# EAGLE design lower_traced_flip2040 (EAGLE 9.6.2)
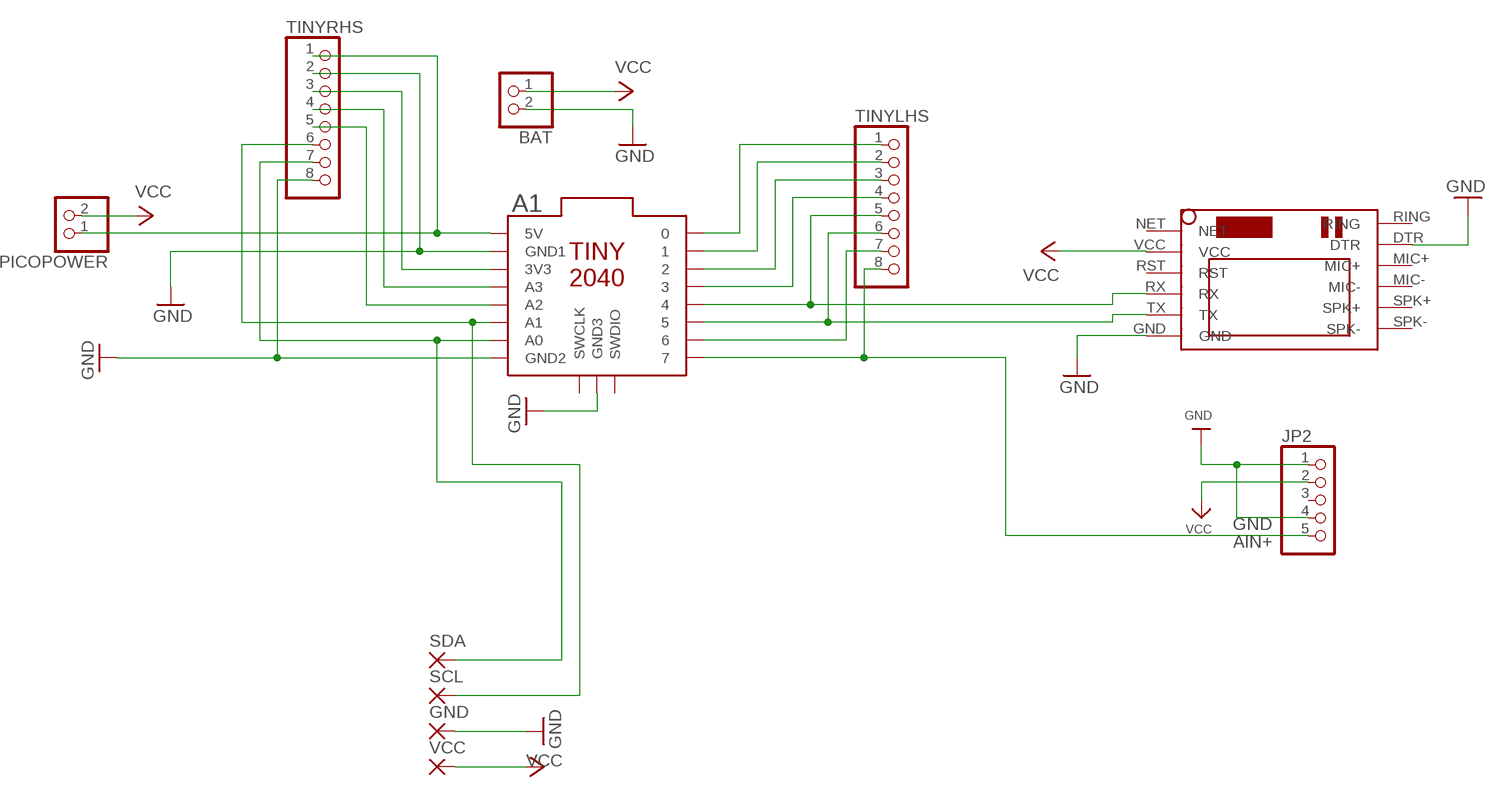
[diagram p0: schematic, sheet 1]

## Parts
A1  TINY2040  [TINY2040]
BAT  JST_2PIN-THM-RA  [JST-PH-2-THM-RA]
GND  3,17/1,1  [3,17/1,1]
JP2  HEADER-1X570MIL  [1X05_ROUND_70]
PICOPOWER  PINHD-1X2  [1X02]
SCL  3,17/1,1  [3,17/1,1]
SDA  3,17/1,1  [3,17/1,1]
TINYLHS  PINHD-1X8  [1X08]
TINYRHS  PINHD-1X8  [1X08]
U$2  SIM800LMODULE  [SIM800LMODULE]
VCC  3,17/1,1  [3,17/1,1]

## Nets
AIN+: A1.7 JP2.5 TINYLHS.8
GND: A1.GND1 A1.GND2 A1.GND3 BAT.2 GND.1(P) JP2.1 JP2.4 TINYRHS.2 TINYRHS.8 U$2.DTR U$2.GND
N$1: A1.4 TINYLHS.5 U$2.RX
N$2: A1.5 TINYLHS.6 U$2.TX
N$3: A1.A1 SCL.1(P) TINYRHS.6
N$4: A1.A0 SDA.1(P) TINYRHS.7
N$5: A1.5V PICOPOWER.1 TINYRHS.1
N$7: A1.6 TINYLHS.7
N$10: A1.3 TINYLHS.4
N$11: A1.2 TINYLHS.3
N$12: A1.1 TINYLHS.2
N$13: A1.0 TINYLHS.1
N$14: A1.A2 TINYRHS.5
N$15: A1.A3 TINYRHS.4
N$16: A1.3V3 TINYRHS.3
VCC: BAT.1 JP2.2 PICOPOWER.2 U$2.VCC VCC.1(P)
Unconnected: A1.SWCLK A1.SWDIO JP2.3 U$2.MIC+ U$2.MIC- U$2.NET U$2.RING U$2.RST U$2.SPK+ U$2.SPK-

## Library data of the parts
A1 = pimoroni-boards:TINY2040
BAT = adafruit:JST_2PIN: JST 2-Pin Connectors of various flavors SMT-RA (S2B-PH-SM4) 4UConnector #17311 SMT (B2B-PH-SM4) THM-RA (S2B-PH) THM (B2B-PH)
GND SCL SDA VCC = wirepad:3,17/1,1: THROUGH-HOLE PAD
JP2 = microbuilder:HEADER-1X5: PIN HEADER
PICOPOWER = pinhead:PINHD-1X2: PIN HEADER
TINYLHS TINYRHS = pinhead:PINHD-1X8: PIN HEADER
U$2 = SIM800LMODULE:SIM800LMODULE: SIM800L Module

## Board
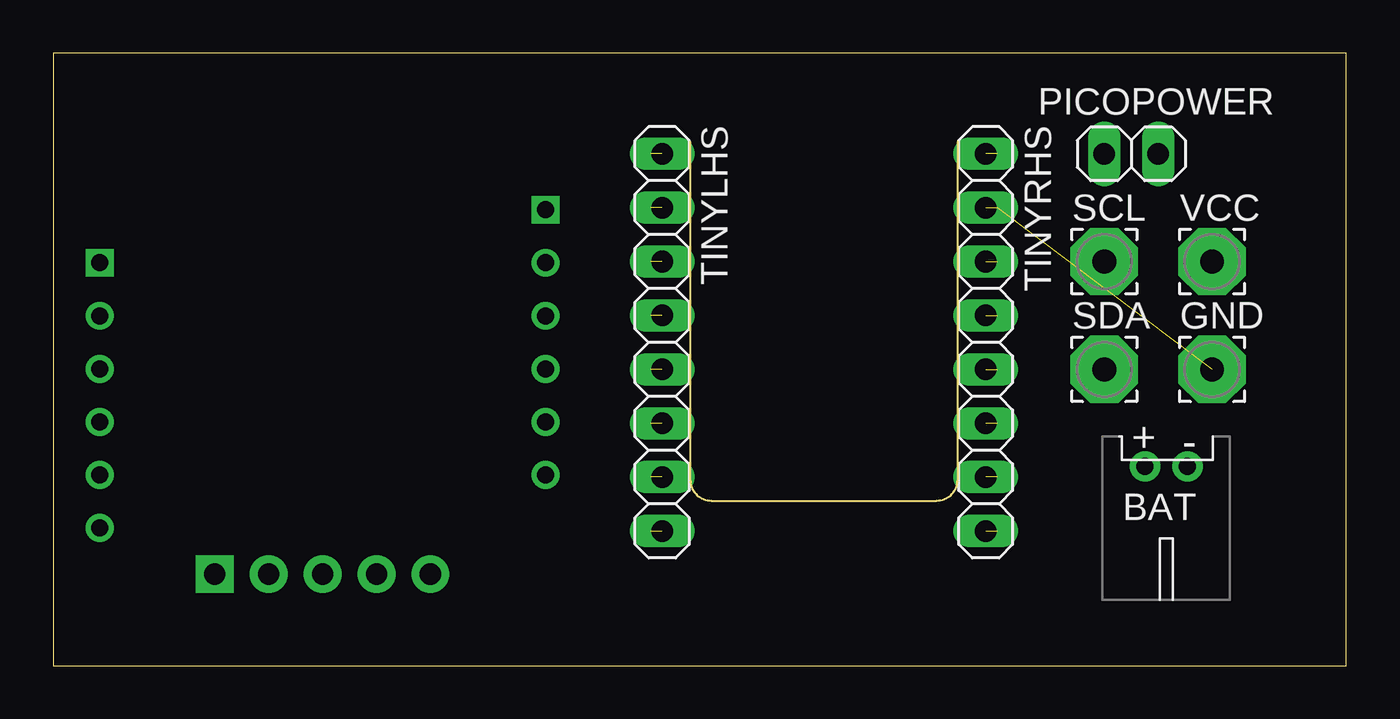
[diagram p1: board, top side]
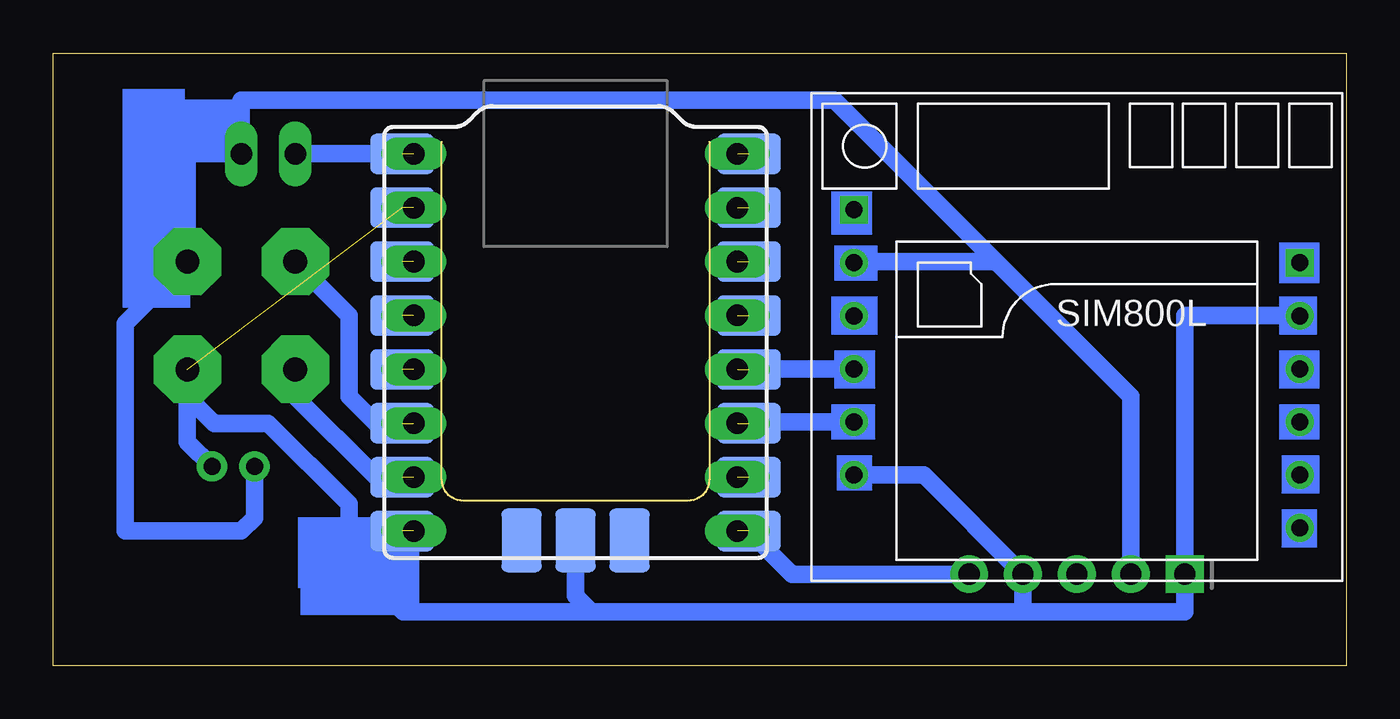
[diagram p2: board, bottom side, seen from below]

Size 60.94 x 28.88 mm. Coordinates in mm from the lower left corner, seen from the top.
Outline: 0,0 60.94,0 60.94,28.88 0,28.88 0,0
Copper layers (1*16): Top 0.035mm / dielectric 1.5mm / Bottom 0.035mm
Design rules "default": minimum track width 6mil, minimum drill 0.35mm, track to track 6mil, track to pad 6mil, pad to pad 6mil, via to via 6mil, smd to smd 6mil, copper to edge 40mil, drill to drill 6mil, minimum pad ring 10mil, minimum via ring 8mil, stop-mask expansion 4mil, vias tented up to drill 0mil, thermal gap 10mil

### Footprints (pad centres in the part's own frame; a part is rotated, then mirrored left to right if it is on the bottom)
TINY2040 = smd 1.9 x 3: 0 1.27,8.17; 1 3.81,8.17; 2 6.35,8.17; 3 8.89,8.17; 3V3 6.35,-8.17; 4 11.43,8.17; 5 13.97,8.17; 5V 1.27,-8.17; 6 16.51,8.17; 7 19.05,8.17; A0 16.51,-8.17; A1 13.97,-8.17; A2 11.43,-8.17; A3 8.89,-8.17; GND1 3.81,-8.17; GND2 19.05,-8.17 | smd 3 x 1.9: GND3 19.49,0; SWCLK 19.49,-2.54; SWDIO 19.49,2.54
JST-PH-2-THM-RA = drill 0.8 pad 1.422: 1 1,0; 2 -1,0
3,17/1,1 = drill 1.118 pad 3.175 octagon: 1 0,0
1X05_ROUND_70 = drill 1 pad 1.778 square: 1 -5.08,0 | drill 1 pad 1.778: 2 -2.54,0; 3 0,0; 4 2.54,0; 5 5.08,0
1X02 = drill 1.016 long: 1 -1.27,0; 2 1.27,0
1X08 = drill 1.016 long: 1 -8.89,0; 2 -6.35,0; 3 -3.81,0; 4 -1.27,0; 5 1.27,0; 6 3.81,0; 7 6.35,0; 8 8.89,0
SIM800LMODULE = drill 0.8: DTR 10.5,1; GND -10.5,-6.5; MIC+ 10.5,-1.5; MIC- 10.5,-4; RST -10.5,1; RX -10.5,-1.5; SPK+ 10.5,-6.5; SPK- 10.5,-9; TX -10.5,-4; VCC -10.5,3.5 | drill 0.8 square: NET -10.5,6; RING 10.5,3.5

### Placement (x,y rotation side)
A1  36.32,25.4 270 bottom
BAT  52.45,9.4 180 top
GND  54.61,13.97 0 top
JP2  12.7,4.32 180 bottom
PICOPOWER  50.8,24.13 0 top
SCL  49.53,19.05 0 top
SDA  49.53,13.97 0 top
TINYLHS  28.7,15.24 270 top
TINYRHS  43.94,15.24 270 top
U$2  12.7,15.49 0 bottom
VCC  54.61,19.05 0 top

### Tracks (layer width: path | path; a pad name or v marks a point on that pad's centre or on a via)
AIN+  (1 unrouted)
  Bottom 0.813: A1.7 26.12,4.32 JP2.5
GND  (3 unrouted)
  Bottom 0.813: U$2.GND 19.92,8.99 JP2.4 15.24,2.54 | 15.24,2.54 7.62,2.54 JP2.1 7.62,16.51 2.22,16.51 U$2.DTR | BAT.2 54.61,10.56 GND.1 54.61,12.7 53.34,11.43 50.8,11.43 46.99,7.62 46.99,6.35 | 46.99,6.35 A1.GND2 | 15.24,2.54 35.56,2.54 | 35.56,2.54 36.32,3.3 A1.GND3 | 35.56,2.54 44.45,2.54 46.99,5.08 46.99,6.35
N$1  (2 unrouted)
  Bottom 0.813: U$2.RX 28.53,13.99 28.55,13.97
N$2  (2 unrouted)
  Bottom 0.813: U$2.TX 28.49,11.49 28.55,11.43
N$3  (1 unrouted)
  Bottom 0.813: 45.21,11.43 A1.A1 45.72,11.43 46.99,12.7 46.99,16.51 SCL.1
N$4  (1 unrouted)
  Bottom 0.813: A1.A0 45.72,8.89 49.53,12.7 SDA.1
N$5  (1 unrouted)
  Bottom 0.813: A1.5V PICOPOWER.1
N$7  (1 unrouted)
N$10  (1 unrouted)
N$11  (1 unrouted)
N$12  (1 unrouted)
N$13  (1 unrouted)
N$14  (1 unrouted)
N$15  (1 unrouted)
N$16  (1 unrouted)
VCC
  Bottom 0.813: JP2.2 10.16,12.7 16.51,19.05 | 16.51,19.05 23.14,19.05 U$2.VCC 23.26,19.05 | 16.51,19.05 24.13,26.67 44.45,26.67 52.07,26.67 PICOPOWER.2 54.61,24.13 VCC.1 57.53,16.13 57.53,6.35 52.07,6.35 51.45,6.97 BAT.1
(copper drawn outside any net)
  shapes: Bottom area x18